# EAGLE design budik (EAGLE 9.2.2)
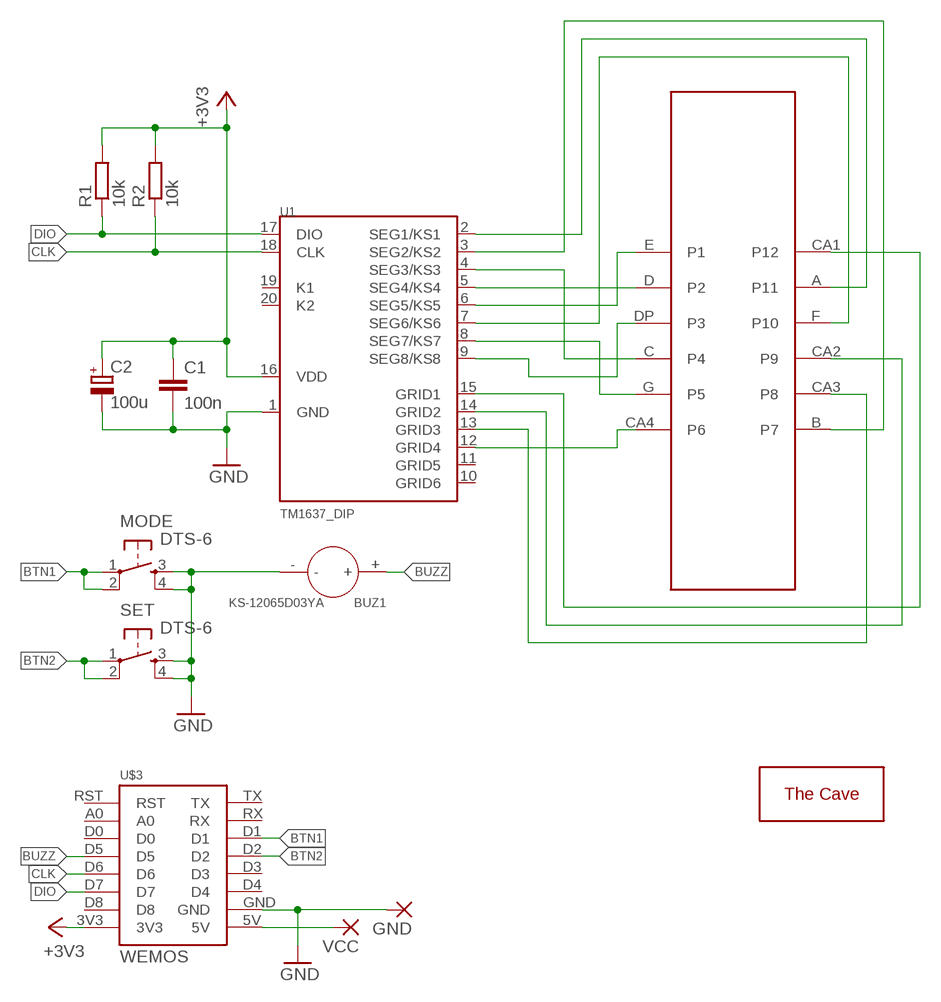
[diagram p0: schematic, sheet 1]

## Parts
BUZ1  KS-12065D03YA  DIP-BUZZER-3V(KS-12065D03YA)  [BZ2-7.6-D12.0XH6.5MM]
C1  100n  C-EU025-025X050  [C025-025X050]
C2  100u  CPOL-EUE3.5-8  [E3,5-8]
GND  WIREPADSMD1,27-254  [SMD1,27-2,54]
MODE  DTS-6  [DTS-6]
R1  10k  R-EU_0207/7  [0207/7]
R2  10k  R-EU_0207/7  [0207/7]
SET  DTS-6  [DTS-6]
U1  TM1637_DIP  [DIL20]
U$1  NFD-5642BX  [DISPLAY]
U$2  THECAVE_LOGO_NEW_TOP_SMALL  [NEW_LOGO_SMALL_TOP]
U$3  WEMOS  [WEMOS]
VCC  WIREPADSMD1,27-254  [SMD1,27-2,54]

## Nets
+3V3: C1.1 C2.+ R1.2 R2.2 U1.16(VDD) U$3.3V3
BTN1: MODE.1 MODE.2 U$3.D1
BTN2: SET.1 SET.2 U$3.D2
BUZZ: BUZ1.+ U$3.D5
CLK: R2.1 U1.18(CLK) U$3.D6
DIO: R1.1 U1.17(DIO) U$3.D7
GND: BUZ1.- C1.2 C2.- GND.1(P) MODE.3 MODE.4 SET.3 SET.4 U1.1(GND) U$3.GND
N$1: U$3.5V VCC.1(P)
N$2: U1.2(SEG1/KS1) U$1.A(P11)
N$3: U1.3(SEG2/KS2) U$1.B(P7)
N$4: U1.4(SEG3/KS3) U$1.C(P4)
N$5: U1.5(SEG4/KS4) U$1.D(P2)
N$6: U1.6(SEG5/KS5) U$1.E(P1)
N$7: U1.7(SEG6/KS6) U$1.F(P10)
N$8: U1.8(SEG7/KS7) U$1.G(P5)
N$9: U1.9(SEG8/KS8) U$1.DP(P3)
N$10: U1.15(GRID1) U$1.CA1(P12)
N$11: U1.14(GRID2) U$1.CA2(P9)
N$12: U1.13(GRID3) U$1.CA3(P8)
N$13: U1.12(GRID4) U$1.CA4(P6)
Unconnected: U1.10(GRID6) U1.11(GRID5) U1.19(K1) U1.20(K2) U$3.A0 U$3.D0 U$3.D3 U$3.D4 U$3.D8 U$3.RST U$3.RX U$3.TX

## Library data of the parts
BUZ1 = Seeed-Connector:DIP-BUZZER-3V(KS-12065D03YA): 312010004; MPN: KS-12065D03YA
C1 = rcl:C-EU: CAPACITOR, European symbol; SPICEPREFIX: C
C2 = rcl:CPOL-EU: POLARIZED CAPACITOR, European symbol; SPICEPREFIX: C
GND VCC = wirepad:WIREPAD: Wire PAD connect wire on PCB
MODE SET = switch-tact:DTS-6
R1 R2 = rcl:R-EU_: RESISTOR, European symbol; SPICEPREFIX: R
U1 = thecave:TM1637: Common Anode 7-segment driver with keyboard scan
U$1 = NFD-5642Xx:NFD-5642BX
U$2 = thecave:THECAVE_LOGO: The Cave DIY workshop logos thecave.cz
U$3 = d1-mini:WEMOS

## Board
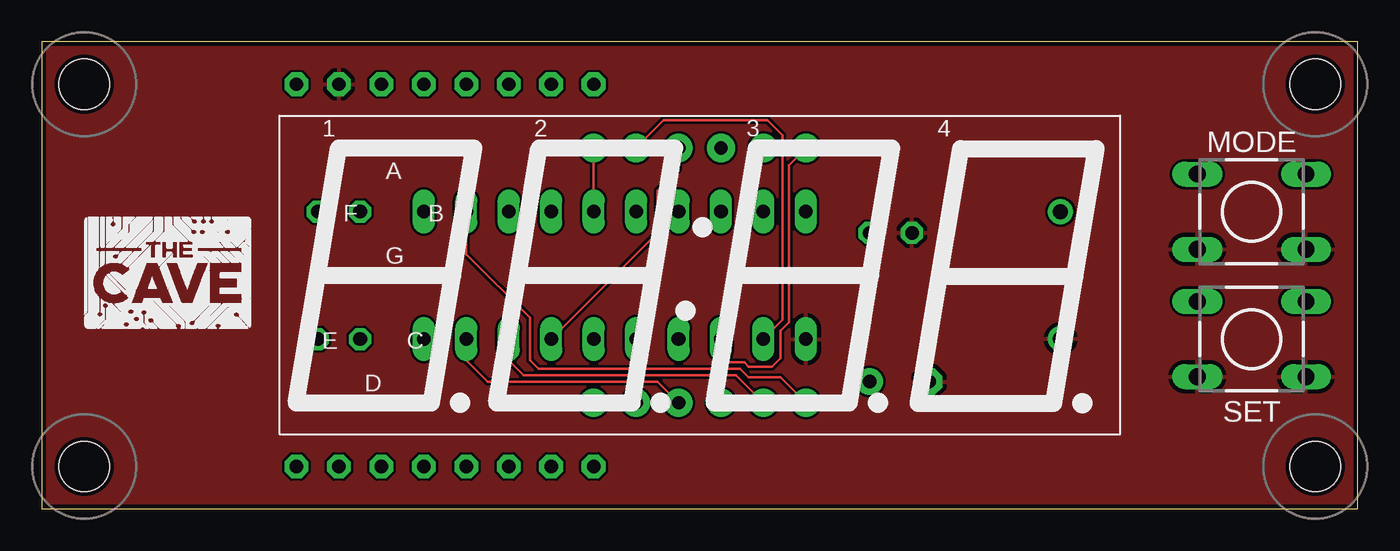
[diagram p1: board, top side]
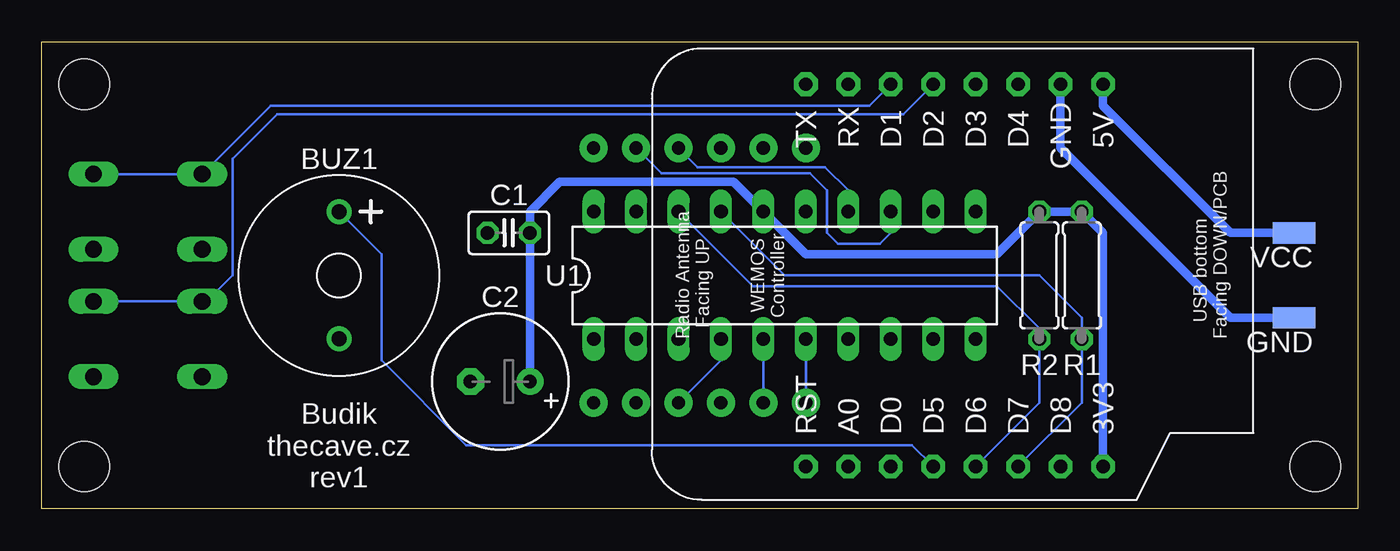
[diagram p2: board, bottom side, seen from below]

Size 78.74 x 27.94 mm. Coordinates in mm from the lower left corner, seen from the top.
Outline: 0,0 78.74,0.01 78.74,27.94 0,27.94 0,0
Copper layers (1*16): Top 0.035mm / dielectric 1.5mm / Bottom 0.035mm
Design rules "SeeedStudio_2layer_DRU_no_angle_20140221": minimum track width 6mil, minimum drill 12mil, track to track 6mil, track to pad 6mil, pad to pad 6mil, via to via 6mil, smd to smd 0mil, copper to edge 10mil, drill to drill 10mil, minimum pad ring 10mil, minimum via ring 6mil, stop-mask expansion 2mil, vias tented up to drill 100mil, thermal gap 10mil
Holes 3 mm at 2.54,25.4 2.54,2.54 76.2,2.54 76.2,25.4

### Footprints (pad centres in the part's own frame; a part is rotated, then mirrored left to right if it is on the bottom)
BZ2-7.6-D12.0XH6.5MM = drill 0.9 pad 1.5: + -3.8,0; - 3.8,0
C025-025X050 = drill 0.813 octagon: 1 -1.27,0; 2 1.27,0
E3,5-8 = drill 0.813 pad 1.6: + -1.778,0 | drill 0.813 pad 1.6 octagon: - 1.778,0
SMD1,27-2,54 = smd 1.27 x 2.54: 1 0,0
DTS-6 = drill 1 long: 1 -3.25,2.25; 2 3.25,2.25; 3 -3.25,-2.25; 4 3.25,-2.25
0207/7 = drill 0.813 octagon: 1 -3.81,0; 2 3.81,0
DIL20 = drill 0.813 long: 1 -11.43,-3.81; 2 -8.89,-3.81; 3 -6.35,-3.81; 4 -3.81,-3.81; 5 -1.27,-3.81; 6 1.27,-3.81; 7 3.81,-3.81; 8 6.35,-3.81; 9 8.89,-3.81; 10 11.43,-3.81; 11 11.43,3.81; 12 8.89,3.81; 13 6.35,3.81; 14 3.81,3.81; 15 1.27,3.81; 16 -1.27,3.81; 17 -3.81,3.81; 18 -6.35,3.81; 19 -8.89,3.81; 20 -11.43,3.81
DISPLAY = drill 0.8 pad 1.676: A -3.806,7.62; B 6.354,7.62; C 1.274,-7.62; CA1 -6.346,7.62; CA2 1.274,7.62; CA3 3.814,7.62; CA4 6.354,-7.62; D -3.806,-7.62; DP -1.266,-7.62; E -6.346,-7.62; F -1.266,7.62; G 3.814,-7.62
WEMOS = drill 0.8 pad 1.422 octagon: 3V3 0,0; 5V 22.86,0; A0 0,15.24; D0 0,12.7; D1 22.86,12.7; D2 22.86,10.16; D3 22.86,7.62; D4 22.86,5.08; D5 0,10.16; D6 0,7.62; D7 0,5.08; D8 0,2.54; GND 22.86,2.54; RST 0,17.78; RX 22.86,15.24; TX 22.86,17.78

### Placement (x,y rotation side)
BUZ1  60.96,13.97 270 bottom
C1  50.8,16.51 180 bottom
C2  51.31,7.62 180 bottom
GND  3.81,11.43 90 bottom
MODE  72.39,17.78 0 top
R1  16.51,13.97 90 bottom
R2  19.05,13.97 90 bottom
SET  72.39,10.16 0 top
U1  34.29,13.97 0 bottom
U$1  39.37,13.97 0 top
U$2  2.54,10.79 0 top
U$3  15.24,2.54 90 bottom
VCC  3.81,16.51 90 bottom

### Tracks (layer width: path | path; a pad name or v marks a point on that pad's centre or on a via)
+3V3
  Bottom 0.508: U$3.3V3 15.24,16.51 R1.2 R2.2 21.59,15.24 33.02,15.24 U1.16 37.34,19.56 47.75,19.56 49.53,17.78 C1.1 C2.+
BTN1
  Bottom 0.152: U$3.D1 29.21,24.13 65.04,24.13 MODE.1 MODE.2
BTN2
  Bottom 0.152: U$3.D2 27.18,23.62 64.64,23.62 67.31,20.95 67.31,13.97 68.87,12.41 SET.1 SET.2
BUZZ
  Bottom 0.152: U$3.D5 26.67,3.81 53.34,3.81 58.42,8.89 58.42,15.23 BUZ1.+
CLK
  Bottom 0.152: U1.18 36.2,13.34 21.59,13.34 19.05,10.79 R2.1 19.05,6.35 U$3.D6
DIO
  Bottom 0.152: U1.17 34.29,13.97 19.05,13.97 16.51,11.43 R1.1 16.51,6.35 U$3.D7
GND
  Bottom 0.508: GND.1 7.62,11.43 17.78,21.59 U$3.GND
  pour Top: 0,27.94 0,0 78.74,0 78.74,27.94
N$1
  Bottom 0.508: VCC.1 7.62,16.51 15.24,24.13 U$3.5V
N$2
  Top 0.152: U$1.A 37.21,23.24 43.43,23.24 44.32,22.35 44.32,11.3 U1.2
N$3
  Top 0.152: U$1.B 44.7,20.57 44.7,11.18 44.2,10.67 44.2,9.02 43.69,8.51 42.29,8.51 42.04,8.76 40.89,8.76 40.64,9.02 U1.3
N$4
  Bottom 0.152: U$1.C 38.1,8.89 U1.4
N$5
  Bottom 0.152: U1.5 U$1.D
N$6
  Bottom 0.152: U1.6 U$1.E
N$7
  Top 0.152: U$1.F 38.1,20.32 36.83,19.05 36.83,16.51 U1.7
N$8
  Top 0.152: U1.8 27.94,8.89 28.83,8 41.53,8 U$1.G
N$9
  Top 0.152: U$1.DP 36.83,7.62 26.67,7.62 25.4,8.89 U1.9
N$10
  Top 0.152: U$1.CA1 U1.15
N$11
  Bottom 0.152: U$1.CA2 39.5,20.45 31.88,20.45 30.48,19.05 U1.14
N$12
  Bottom 0.152: U$1.CA3 41.66,20.07 32.77,20.07 31.75,19.05 31.75,16.51 31.11,15.88 28.57,15.88 27.94,16.51 U1.13
N$13
  Top 0.152: U1.12 25.4,15.24 29.21,11.43 29.21,8.89 29.72,8.38 41.78,8.38 42.29,7.87 44.2,7.87 U$1.CA4

### Text on the board
bPlace: Budik / thecave.cz / rev1